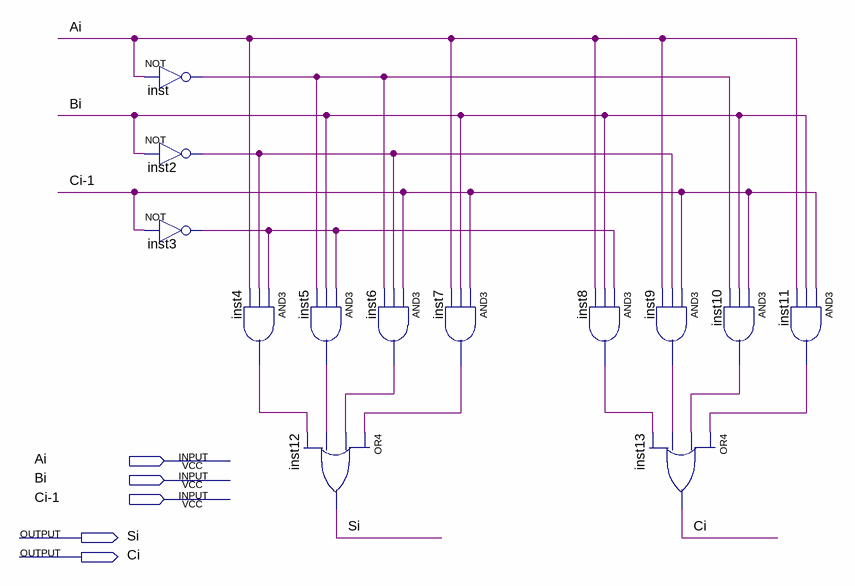
[diagram p0: schematic sheet]
// Quartus schematic adder_1_bit.bdf as structural Verilog: 13 symbols, 5 pins
module adder_1_bit (
  input  Ai,
  input  Bi,
  input  \Ci-1 ,
  output Si,
  output Ci
);

  wire inst2_out, inst3_out, inst4_out, inst5_out, inst6_out, inst7_out, inst8_out, inst9_out, inst10_out,
       inst11_out, inst_out;

  not inst (inst_out, Ai);
  not inst2 (inst2_out, Bi);
  not inst3 (inst3_out, \Ci-1 );
  and inst4 (inst4_out, inst3_out, inst2_out, Ai);
  and inst5 (inst5_out, inst3_out, Bi, inst_out);
  or inst12 (Si, inst7_out, inst6_out, inst5_out, inst4_out);
  and inst6 (inst6_out, \Ci-1 , inst2_out, inst_out);
  and inst7 (inst7_out, \Ci-1 , Bi, Ai);
  and inst8 (inst8_out, inst3_out, Bi, Ai);
  and inst9 (inst9_out, \Ci-1 , inst2_out, Ai);
  or inst13 (Ci, inst11_out, inst10_out, inst9_out, inst8_out);
  and inst10 (inst10_out, \Ci-1 , Bi, inst_out);
  and inst11 (inst11_out, \Ci-1 , Bi, Ai);
endmodule
